# Altium schematic sheet CON_USERJTAG_10WBOXHDRRAM.SchDoc: User-Board JTAG Header
size A4; Organization: Altium Limited.; Address1: Level 3, 12a Rodborough Rd; Address2: Frenchs Forest 2086; Address3: NSW; Address4: AUSTRALIA; SheetNumber: 1; SheetTotal: 100
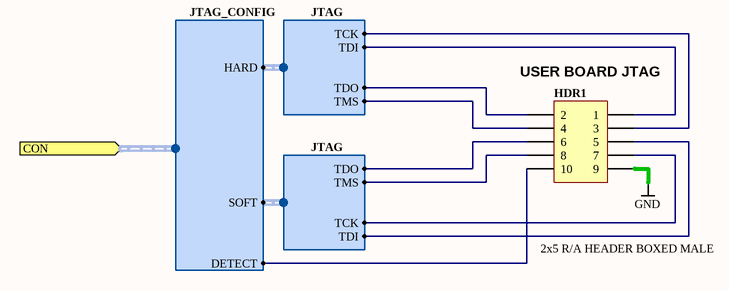
[diagram p0: CON_USERJTAG_10WBOXHDRRAM.SchDoc]

## Parts
HDR1  2x5 R/A HEADER BOXED MALE  [918510x323]

## Ports
CON (harness JTAG_CONFIG)

## Harnesses
JTAG_CONFIG: HARD, SOFT, DETECT
JTAG: TDI, TDO, TCK, TMS

## Nets
GND: HDR1.9
NetHDR1_1: HDR1.1 ; harness JTAG.TDI
NetHDR1_2: HDR1.2 ; harness JTAG.TDO
NetHDR1_3: HDR1.3 ; harness JTAG.TCK
NetHDR1_4: HDR1.4 ; harness JTAG.TMS
NetHDR1_5: HDR1.5 ; harness JTAG.TDI
NetHDR1_6: HDR1.6 ; harness JTAG.TDO
NetHDR1_7: HDR1.7 ; harness JTAG.TCK
NetHDR1_8: HDR1.8 ; harness JTAG.TMS
NetHDR1_10: HDR1.10 ; port CON.DETECT

## Notes on the sheet
- (near HDR1) USER BOARD JTAG
- Sheet Title
- Project Title
- Size:
- Date:
- A4
- Assy:
- Time:
- Revision:
- Sheet
- of
- File:

## Library data of the parts
HDR1 = D-300-0014: Header IDC, 2 x 5 Pin Right-Angle 2.54mm Pitch (Boxed-Male); Max Current: 3 A; Category: Connector; Connector type: Header; Mounting Technology: Through-Hole; Pin Count: 10; Status: Production